# Altium schematic sheet PCIE Connector.SchDoc: RK3399 COB Design V1.0
size A3; Author: AVIRAL MISHRA; DocumentNumber: 27; SheetNumber: 27; SheetTotal: 27; PROJECT CODE: A_V1.0
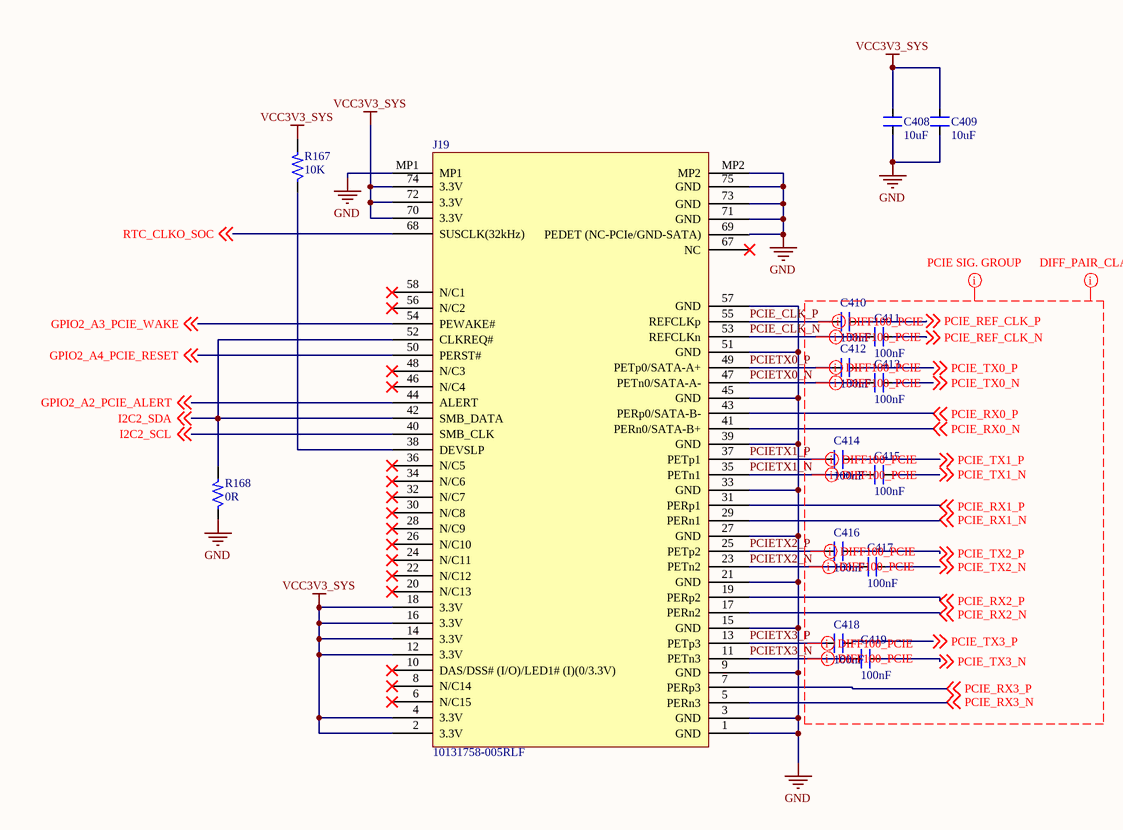
[diagram p0: PCIE Connector.SchDoc]

## Parts
C408  10uF  [CAP_0603]
C409  10uF  [CAP_0603]
C410  100nF  [CAP_0402]
C411  100nF  [CAP_0402]
C412  100nF  [CAP_0402]
C413  100nF  [CAP_0402]
C414  100nF  [CAP_0402]
C415  100nF  [CAP_0402]
C416  100nF  [CAP_0402]
C417  100nF  [CAP_0402]
C418  100nF  [CAP_0402]
C419  100nF  [CAP_0402]
J19  10131758-005RLF  [PCIE_10131758-005RLF]
R167  10K  [RES_0603]
R168  0R  [RES_0603]

## Nets
GND: C408.1 C409.1 J19.1(GND) J19.3(GND) J19.9(GND) J19.15(GND) J19.21(GND) J19.27(GND) J19.33(GND) J19.39(GND) J19.45(GND) J19.51(GND) J19.57(GND) J19.69(PEDET_(NC-PCIe/GND-SATA)) J19.71(GND) J19.73(GND) J19.75(GND) J19.MP1 J19.MP2 R168.1
VCC3V3_SYS: C408.2 C409.2 J19.2(3.3V) J19.4(3.3V) J19.12(3.3V) J19.14(3.3V) J19.16(3.3V) J19.18(3.3V) J19.70(3.3V) J19.72(3.3V) J19.74(3.3V) R167.2
GPIO2_A2_PCIE_ALERT: J19.44(ALERT) ; off-sheet GPIO2_A2_PCIE_ALERT
GPIO2_A3_PCIE_WAKE: J19.54(PEWAKE#) ; off-sheet GPIO2_A3_PCIE_WAKE
GPIO2_A4_PCIE_RESET: J19.50(PERST#) ; off-sheet GPIO2_A4_PCIE_RESET
I2C2_SCL: J19.40(SMB_CLK) ; off-sheet I2C2_SCL
I2C2_SDA: J19.42(SMB_DATA) J19.52(CLKREQ#) R168.2 ; off-sheet I2C2_SDA
PCIE_CLK_N: C411.1 J19.53(REFCLKn)
PCIE_CLK_P: C410.1 J19.55(REFCLKp)
PCIE_REF_CLK_N: C411.2 ; off-sheet PCIE_REF_CLK_N
PCIE_REF_CLK_P: C410.2 ; off-sheet PCIE_REF_CLK_P
PCIE_RX0_N: J19.41(PERn0/SATA-B+) ; off-sheet PCIE_RX0_N
PCIE_RX0_P: J19.43(PERp0/SATA-B-) ; off-sheet PCIE_RX0_P
PCIE_RX1_N: J19.29(PERn1) ; off-sheet PCIE_RX1_N
PCIE_RX1_P: J19.31(PERp1) ; off-sheet PCIE_RX1_P
PCIE_RX2_N: J19.17(PERn2) ; off-sheet PCIE_RX2_N
PCIE_RX2_P: J19.19(PERp2) ; off-sheet PCIE_RX2_P
PCIE_RX3_N: J19.5(PERn3) ; off-sheet PCIE_RX3_N
PCIE_RX3_P: J19.7(PERp3) ; off-sheet PCIE_RX3_P
PCIE_TX0_N: C413.2 ; off-sheet PCIE_TX0_N
PCIE_TX0_P: C412.2 ; off-sheet PCIE_TX0_P
PCIE_TX1_N: C415.2 ; off-sheet PCIE_TX1_N
PCIE_TX1_P: C414.2 ; off-sheet PCIE_TX1_P
PCIE_TX2_N: C417.2 ; off-sheet PCIE_TX2_N
PCIE_TX2_P: C416.2 ; off-sheet PCIE_TX2_P
PCIE_TX3_N: C419.2 ; off-sheet PCIE_TX3_N
PCIE_TX3_P: C418.2 ; off-sheet PCIE_TX3_P
PCIETX0_N: C413.1 J19.47(PETn0/SATA-A-)
PCIETX0_P: C412.1 J19.49(PETp0/SATA-A+)
PCIETX1_N: C415.1 J19.35(PETn1)
PCIETX1_P: C414.1 J19.37(PETp1)
PCIETX2_N: C417.1 J19.23(PETn2)
PCIETX2_P: C416.1 J19.25(PETp2)
PCIETX3_N: C419.1 J19.11(PETn3)
PCIETX3_P: C418.1 J19.13(PETp3)
RTC_CLKO_SOC: J19.68(SUSCLK(32kHz)) ; off-sheet RTC_CLKO_SOC
NetJ19_38: J19.38(DEVSLP) R167.1

Not connected (* = marked no-connect by the designer): J19 6(N/C15)* 8(N/C14)* 10(DAS/DSS#_(I/O)/LED1#_(I)(0/3.3V))* 20(N/C13)* 22(N/C12)* 24(N/C11)* 26(N/C10)* 28(N/C9)* 30(N/C8)* 32(N/C7)* 34(N/C6)* 36(N/C5)* 46(N/C4)* 48(N/C3)* 56(N/C2)* 58(N/C1)* 67(NC)*

## Layout directives
differential pair; differential pair class DIFF100_PCIE: PCIE_CLK_N, PCIE_CLK_P, PCIETX0_N, PCIETX0_P, PCIETX1_N, PCIETX1_P, PCIETX2_N, PCIETX2_P, PCIETX3_N, PCIETX3_P
net class PCIE SIG. GROUP: PCIE_REF_CLK_N, PCIE_REF_CLK_P, PCIE_RX0_N, PCIE_RX0_P, PCIE_RX1_N, PCIE_RX1_P, PCIE_RX2_N, PCIE_RX2_P, PCIE_RX3_N, PCIE_RX3_P, PCIE_TX0_N, PCIE_TX0_P, PCIE_TX1_N, PCIE_TX1_P, PCIE_TX2_N, PCIE_TX2_P, PCIE_TX3_N, PCIE_TX3_P
net class DIFF_PAIR_CLASS: PCIE_REF_CLK_N, PCIE_REF_CLK_P, PCIE_RX0_N, PCIE_RX0_P, PCIE_RX1_N, PCIE_RX1_P, PCIE_RX2_N, PCIE_RX2_P, PCIE_RX3_N, PCIE_RX3_P, PCIE_TX0_N, PCIE_TX0_P, PCIE_TX1_N, PCIE_TX1_P, PCIE_TX2_N, PCIE_TX2_P, PCIE_TX3_N, PCIE_TX3_P

## Notes on the sheet
- TITLE:
- DOCUMENT NAME:
- SCALE 1:1
- This document is copyright of EsteemPCB and shall not be revealed, produced, copied, in whole or in part, nor
- PROJECT CODE:
- TEMPLATE:
- A4
- AUTHOR:
- Sheet
- of
- used for any purpose other than submitted.

## Library data of the parts
C408 C409 = CAP_10uF-10V-10%-0603: 10µF ±10% 10V Ceramic Capacitor X5R 0603 (1608 Metric) /; Manufacturer Part Number: GRM188R61A106KE69J; Manufacturer: Murata Electronics; Case/Package: 0603; Supplier-1: Digikey
C410-C419 = CAP_100nF-10V-10%-0402: 0.1µF ±10% 10V Ceramic Capacitor X7R 0402 (1005 Metric) /; Manufacturer: Yageo; Manufacturer Part Number: CC0402KRX7R6BB104; Case/Package: 0402; Supplier-1: Digikey
J19 = CON-PLG_67X1-10131758-005RLF-SMD: PCI Express/PCI Connectors M.2 connector, 8.5H, M key; Manufacturer: Amphenol ICC (FCI); Manufacturer Part Number: 10131758-005RLF; Case/Package: M.2 8.5H_STD_M; Supplier-1: Digikey
R167 = RES_10K-0.1W-1%-0603: 10 kOhms ±1% 0.1W, 1/10W Chip Resistor 0603 (1608 Metric) Thick Film /; Manufacturer: Yageo; Manufacturer Part Number: RC0603FR-0710KL; Case/Package: 0603; Supplier-1: Digikey
R168 = RES_0R-0.1W-1%-0603: 0 Ohms Jumper 0.1W, 1/10W Chip Resistor 0603 (1608 Metric) Thick Film; Manufacturer: Yageo; Manufacturer Part Number: RC0603JR-070RL; Case/Package: 0603; Supplier-1: Digikey